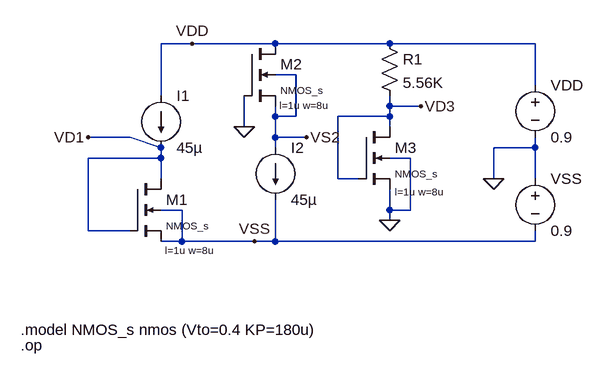
[diagram p0: schematic Week3_Problem1.asc]
Week3_Problem1.asc, the LTspice schematic file:
Version 4.1
SHEET 1 880 680
WIRE -80 -64 -128 -64
WIRE 48 -64 -80 -64
WIRE 224 -64 48 -64
WIRE 448 -64 224 -64
WIRE 80 -16 48 -16
WIRE 448 0 448 -64
WIRE -128 16 -128 -64
WIRE 224 32 224 16
WIRE 272 32 224 32
WIRE 48 48 48 32
WIRE 80 48 80 -16
WIRE 80 48 48 48
WIRE 224 48 224 32
WIRE 224 48 144 48
WIRE 0 64 0 16
WIRE 224 64 224 48
WIRE -176 80 -240 80
WIRE 48 80 48 48
WIRE 96 80 48 80
WIRE -128 96 -176 80
WIRE 48 96 48 80
WIRE 448 96 448 80
WIRE 448 96 384 96
WIRE -128 112 -128 96
WIRE -128 112 -240 112
WIRE 256 112 224 112
WIRE -128 144 -128 112
WIRE 144 144 144 48
WIRE 176 144 144 144
WIRE 384 144 384 96
WIRE 448 144 448 96
WIRE -96 192 -128 192
WIRE 224 192 224 160
WIRE 256 192 256 112
WIRE 256 192 224 192
WIRE 224 208 224 192
WIRE -240 224 -240 112
WIRE -176 224 -240 224
WIRE -96 240 -96 192
WIRE -96 240 -128 240
WIRE 16 240 -96 240
WIRE 48 240 48 176
WIRE 48 240 16 240
WIRE 448 240 448 224
WIRE 448 240 48 240
FLAG 224 208 0
FLAG 0 64 0
FLAG 384 144 0
FLAG -240 80 VD1
FLAG 96 80 VS2
FLAG 272 32 VD3
FLAG -80 -64 VDD
FLAG 16 240 VSS
SYMBOL res 208 -80 R0
SYMATTR InstName R1
SYMATTR Value 5.56K
SYMBOL voltage 448 -16 R0
WINDOW 123 0 0 Left 0
WINDOW 39 0 0 Left 0
SYMATTR InstName VDD
SYMATTR Value 0.9
SYMBOL voltage 448 128 R0
WINDOW 123 0 0 Left 0
WINDOW 39 0 0 Left 0
SYMATTR InstName VSS
SYMATTR Value 0.9
SYMBOL current -128 16 R0
WINDOW 123 0 0 Left 0
WINDOW 39 0 0 Left 0
SYMATTR InstName I1
SYMATTR Value 45µ
SYMBOL current 48 96 R0
WINDOW 123 0 0 Left 0
WINDOW 39 0 0 Left 0
SYMATTR InstName I2
SYMATTR Value 45µ
SYMBOL nmos4 -176 144 R0
WINDOW 123 54 110 Left 1
WINDOW 3 56 72 Left 1
SYMATTR Value2 l=1u w=8u
SYMATTR Value NMOS_s
SYMATTR InstName M1
SYMBOL nmos4 0 -64 R0
WINDOW 123 54 95 Left 1
WINDOW 3 56 72 Left 1
SYMATTR Value2 l=1u w=8u
SYMATTR Value NMOS_s
SYMATTR InstName M2
SYMBOL nmos4 176 64 R0
WINDOW 123 56 100 Left 1
WINDOW 3 56 72 Left 1
SYMATTR Value2 l=1u w=8u
SYMATTR Value NMOS_s
SYMATTR InstName M3
TEXT -344 376 Left 2 !.model NMOS_s nmos (Vto=0.4 KP=180u)
TEXT -344 400 Left 2 !.op

The netlist it stands for:
* Week3_Problem1.asc
R1 VDD VD3 5.56K
VDD VDD 0 0.9
VSS 0 VSS 0.9
I1 VDD VD1 45µ
I2 VS2 VSS 45µ
M1 VD1 VD1 VSS VSS NMOS_s l=1u w=8u
M2 VDD 0 VS2 VS2 NMOS_s l=1u w=8u
M3 VD3 VD3 0 0 NMOS_s l=1u w=8u
.model NMOS NMOS
.model PMOS PMOS
.lib standard.mos
.model NMOS_s nmos (Vto=0.4 KP=180u)
.op
.backanno
.end

* Results of the author's LTspice run, read from the files saved beside the schematic
* Operating Point:
*   V(vd3) = 649.9 mV
*   V(vd1) = -250 mV
*   V(vs2) = -650 mV
*   V(vdd) = 900 mV
*   V(vss) = -900 mV
*   I(I2) = 45 µA
*   Id(M1) = 45 µA
*   Ig(M1) = 0 A
*   Is(M1) = -45 µA
*   Ib(M1) = -660 fA
*   I(R1) = 44.98 µA
*   I(VSS) = -90 µA
*   Id(M3) = 44.98 µA
*   Ig(M3) = 0 A
*   Is(M3) = -44.98 µA
*   Ib(M3) = -659.9 fA
*   I(VDD) = -135 µA
*   I(I1) = 45 µA
*   Id(M2) = 45 µA
*   Ig(M2) = 0 A
*   Is(M2) = -45 µA
*   Ib(M2) = -1.56 pA